# EAGLE schematic Car (EAGLE 9.0.1)
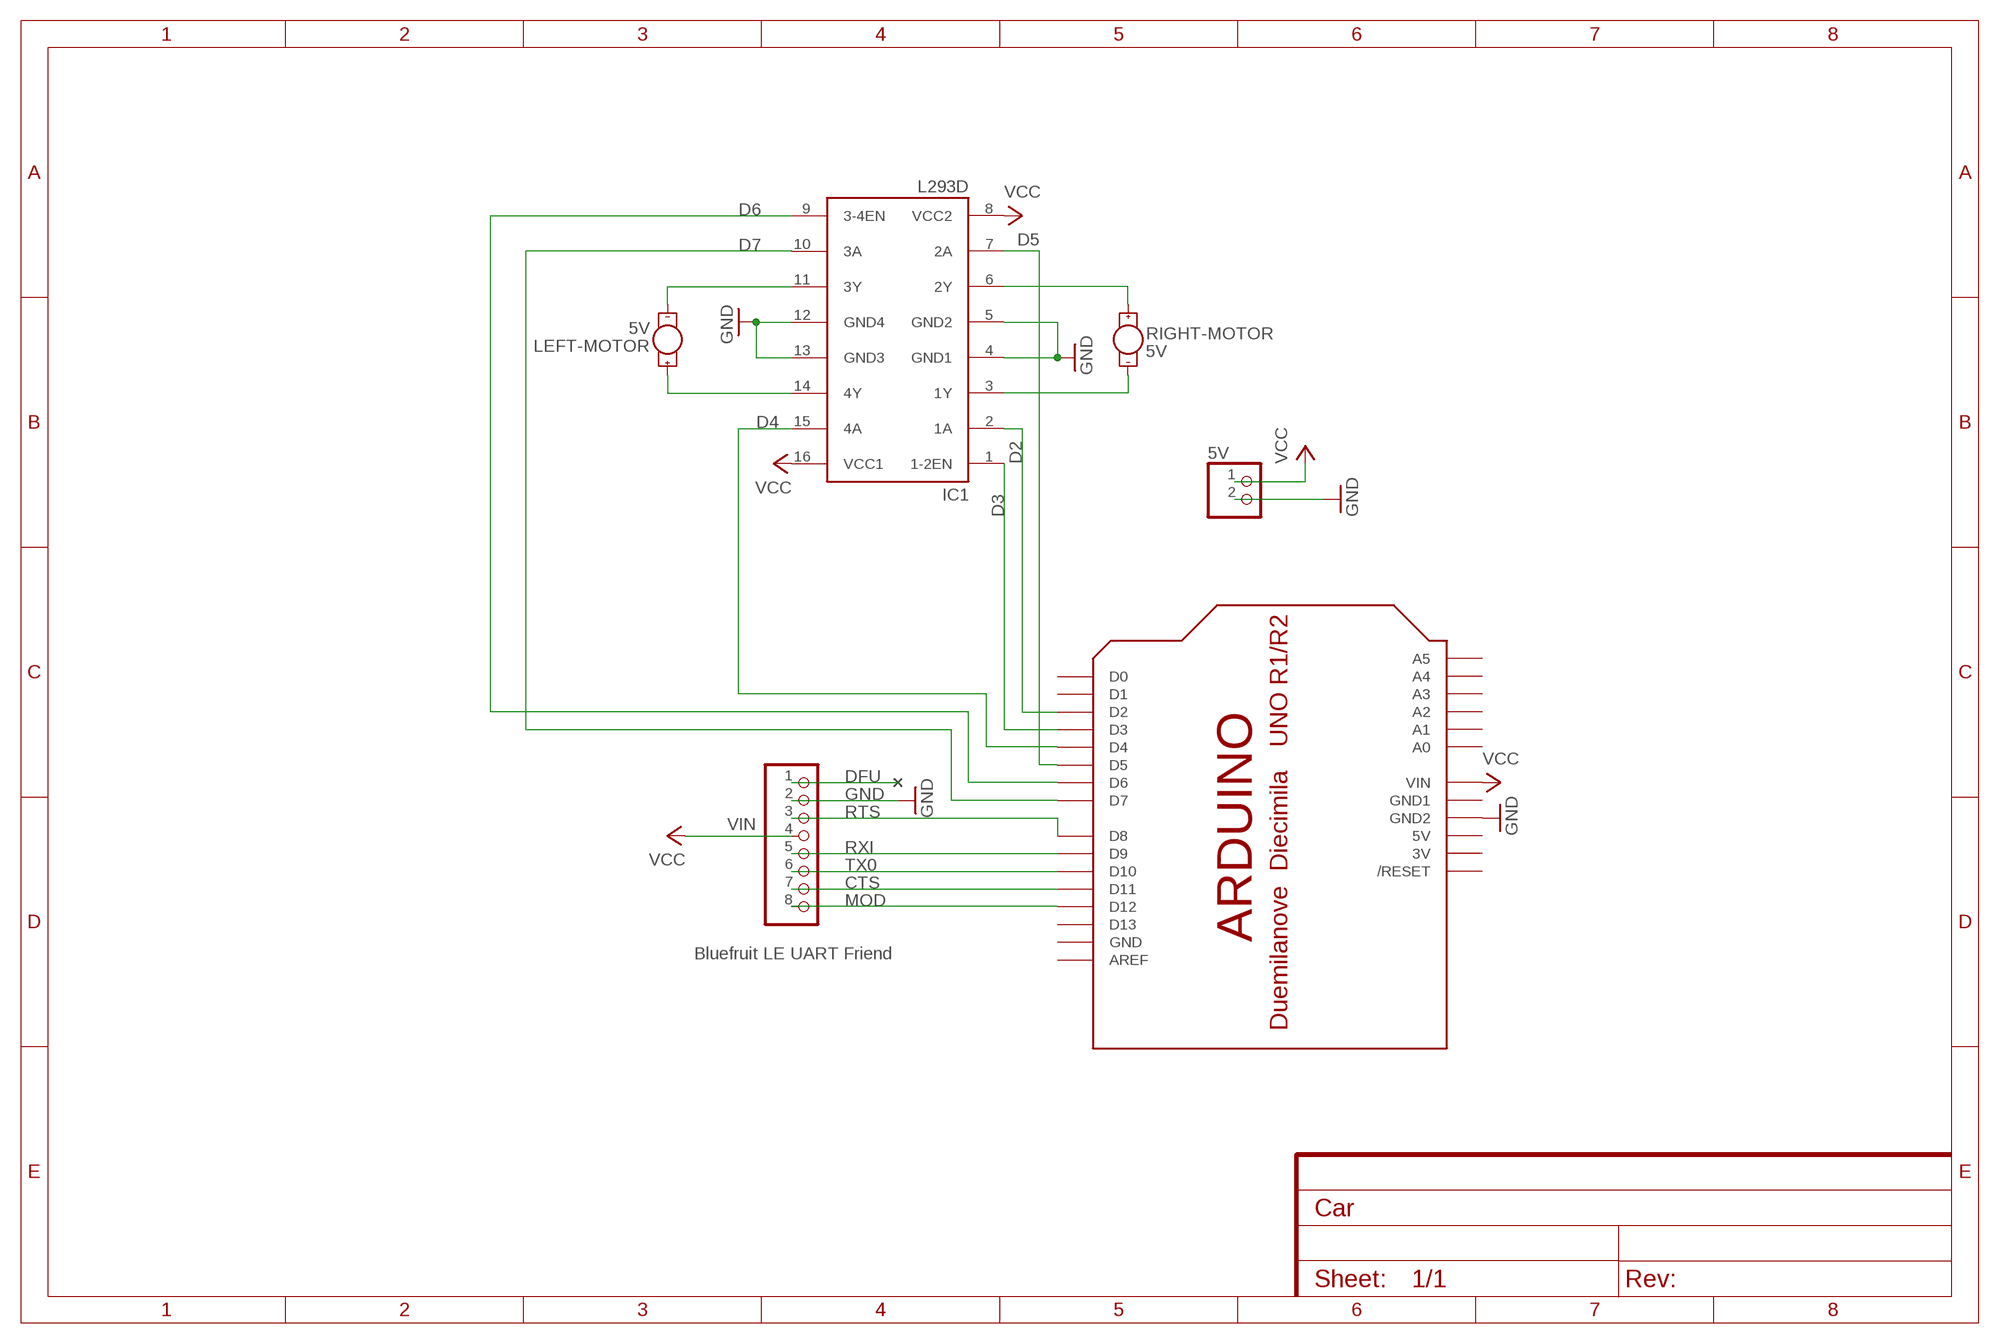
[diagram p0: schematic, sheet 1]
FRAME1 (FRAME-A4L): CNAME: Bluetooth Controlled Car; CREVISION: 1; DESIGNER: Pedro Palacios Almendros

## Parts
5V  PINHD-1X2  [1X02]
BLE  Bluefruit LE UART Friend  HEADER-1X876MIL  [1X08_ROUND_76]
IC1  L293D  [DIL16]
LEFT-MOTOR  5V  MOTOR10MM  [VIBE-MOTOR-10MM]
RIGHT-MOTOR  5V  MOTOR10MM  [VIBE-MOTOR-10MM]
U$1  ARDUINOUNO  [ARDUINO]

## Nets
5V: 5V.1 ; supply symbol labelled VCC
CTS: BLE.7 U$1.D11
D2: IC1.2(1A) U$1.D2
D3: IC1.1(1-2EN) U$1.D3
D4: IC1.15(4A) U$1.D4
D5: IC1.7(2A) U$1.D5
D6: IC1.9(3-4EN) U$1.D6
D7: IC1.10(3A) U$1.D7
DFU: BLE.1
GND: 5V.2 BLE.2 IC1.4(GND1) IC1.5(GND2) IC1.12(GND4) IC1.13(GND3) U$1.GND2
MOD: BLE.8 U$1.D12
N$1: IC1.14(4Y) LEFT-MOTOR.+
N$2: IC1.11(3Y) LEFT-MOTOR.-
N$3: IC1.6(2Y) RIGHT-MOTOR.+
N$4: IC1.3(1Y) RIGHT-MOTOR.-
RTS: BLE.3 U$1.D8
RXI: BLE.5 U$1.D9
TX0: BLE.6 U$1.D10
VCC: IC1.8(VCC2) IC1.16(VCC1) U$1.VIN
VIN: BLE.4 ; supply symbol labelled VCC
Unconnected: U$1.A0 U$1.A1 U$1.A2 U$1.A3 U$1.A4 U$1.A5 U$1.AREF U$1.D0 U$1.D1 U$1.D13 U$1.RESET(/RESET)

## Power pins joined to a net without a drawn wire
3V: U$1.3V
5V: U$1.5V
GND: U$1.GND
GND1: U$1.GND1

## Library data of the parts
5V = pinhead:PINHD-1X2: PIN HEADER
BLE = microbuilder:HEADER-1X8: PIN HEADER
IC1 = st-microelectronics:L293D: PUSH-PULL 4 CHANNEL DRIVER; MPN: L293D; OC_FARNELL: 9589619; OC_NEWARK: 56P8249
LEFT-MOTOR RIGHT-MOTOR = SparkFun-Electromechanical:MOTOR: Motor (Single-Phase) Two-terminal, single-phase motors. SparkFun Products Vibration Motor <https://www.sparkfun.com/products/8449> (ROB-08449) Physical dimension and wire connections for this powerful vibration motor. Motor has a self adhesive backing.; PROD_ID: COMP-08572; SF_SKU: ROB-08449
U$1 = adafruit:ARDUINO: Arduino Diecimila/Duemilanove Make a shield with ease, this package has all the named pins as well as the two mounting drill holes and an outline of the USB and DC power connector. The outline is on the DIMENSION layer, so if your board house uses it they will cut the outline to match. http://www.ladyada.net/library/pcb/eaglelibrary.html